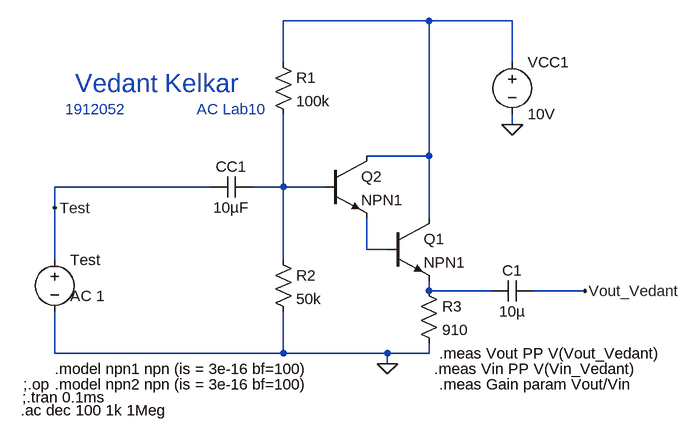
[diagram p0: schematic AC_Lab10a.asc]
AC_Lab10a.asc, the LTspice schematic file:
Version 4
SHEET 1 880 680
WIRE 256 -368 32 -368
WIRE 384 -368 256 -368
WIRE 32 -304 32 -368
WIRE 384 -304 384 -368
WIRE 384 -208 384 -224
WIRE 256 -160 256 -368
WIRE 256 -160 160 -160
WIRE -80 -112 -320 -112
WIRE 32 -112 32 -224
WIRE 32 -112 -16 -112
WIRE 96 -112 32 -112
WIRE -320 -80 -320 -112
WIRE 256 -64 256 -160
WIRE 160 -16 160 -64
WIRE 192 -16 160 -16
WIRE -320 0 -320 -80
WIRE 32 0 32 -112
WIRE 256 48 256 32
WIRE 352 48 256 48
WIRE 496 48 416 48
WIRE -320 144 -320 80
WIRE 32 144 32 80
WIRE 32 144 -320 144
WIRE 192 144 32 144
WIRE 256 144 256 128
WIRE 256 144 192 144
WIRE 192 160 192 144
FLAG 384 -208 0
FLAG 192 160 0
FLAG -320 -80 Test
FLAG 496 48 Vout_Vedant
SYMBOL res 16 -320 R0
SYMATTR InstName R1
SYMATTR Value 100k
SYMBOL res 16 -16 R0
SYMATTR InstName R2
SYMATTR Value 50k
SYMBOL npn 192 -64 R0
SYMATTR InstName Q1
SYMATTR Value NPN1
SYMBOL cap -16 -128 R90
WINDOW 0 0 32 VBottom 2
WINDOW 3 32 32 VTop 2
SYMATTR InstName CC1
SYMATTR Value 10µF
SYMBOL voltage -320 -16 R0
WINDOW 123 24 72 Left 2
WINDOW 39 0 0 Left 0
WINDOW 3 24 44 Left 2
SYMATTR Value2 AC 1
SYMATTR InstName Test
SYMATTR Value ""
SYMBOL voltage 384 -320 R0
SYMATTR InstName VCC1
SYMATTR Value 10V
SYMBOL npn 96 -160 R0
SYMATTR InstName Q2
SYMATTR Value NPN1
SYMBOL res 240 32 R0
SYMATTR InstName R3
SYMATTR Value 910
SYMBOL cap 416 32 R90
WINDOW 0 0 32 VBottom 2
WINDOW 3 32 32 VTop 2
SYMATTR InstName C1
SYMATTR Value 10µ
TEXT -288 -272 Left 4 ;Vedant Kelkar
TEXT -304 -232 Left 2 ;1912052                AC Lab10
TEXT -320 168 Left 2 !.model npn1 npn (is = 3e-16 bf=100)
TEXT -368 192 Left 2 !;.op
TEXT -320 192 Left 2 !.model npn2 npn (is = 3e-16 bf=100)
TEXT -370 212 Left 2 !;.tran 0.1ms
TEXT 272 144 Left 2 !.meas Vout PP V(Vout_Vedant)
TEXT 264 168 Left 2 !.meas Vin PP V(Vin_Vedant)
TEXT 272 192 Left 2 !.meas Gain param Vout/Vin
TEXT -372 232 Left 2 !.ac dec 100 1k 1Meg

The netlist it stands for:
* AC_Lab10a.asc
R1 N001 N002 100k
R2 N002 0 50k
Q1 N001 N003 N004 0 NPN1
CC1 N002 Test 10µF
V§Test Test 0 AC 1
VCC1 N001 0 10V
Q2 N001 N002 N003 0 NPN1
R3 N004 0 910
C1 Vout_Vedant N004 10µ
.model NPN NPN
.model PNP PNP
.lib standard.bjt
* Vedant Kelkar
* 1912052                AC Lab10
.model npn1 npn (is = 3e-16 bf=100)
;.op
.model npn2 npn (is = 3e-16 bf=100)
;.tran 0.1ms
.meas Vout PP V(Vout_Vedant)
.meas Vin PP V(Vin_Vedant)
.meas Gain param Vout/Vin
.ac dec 100 1k 1Meg
.backanno
.end